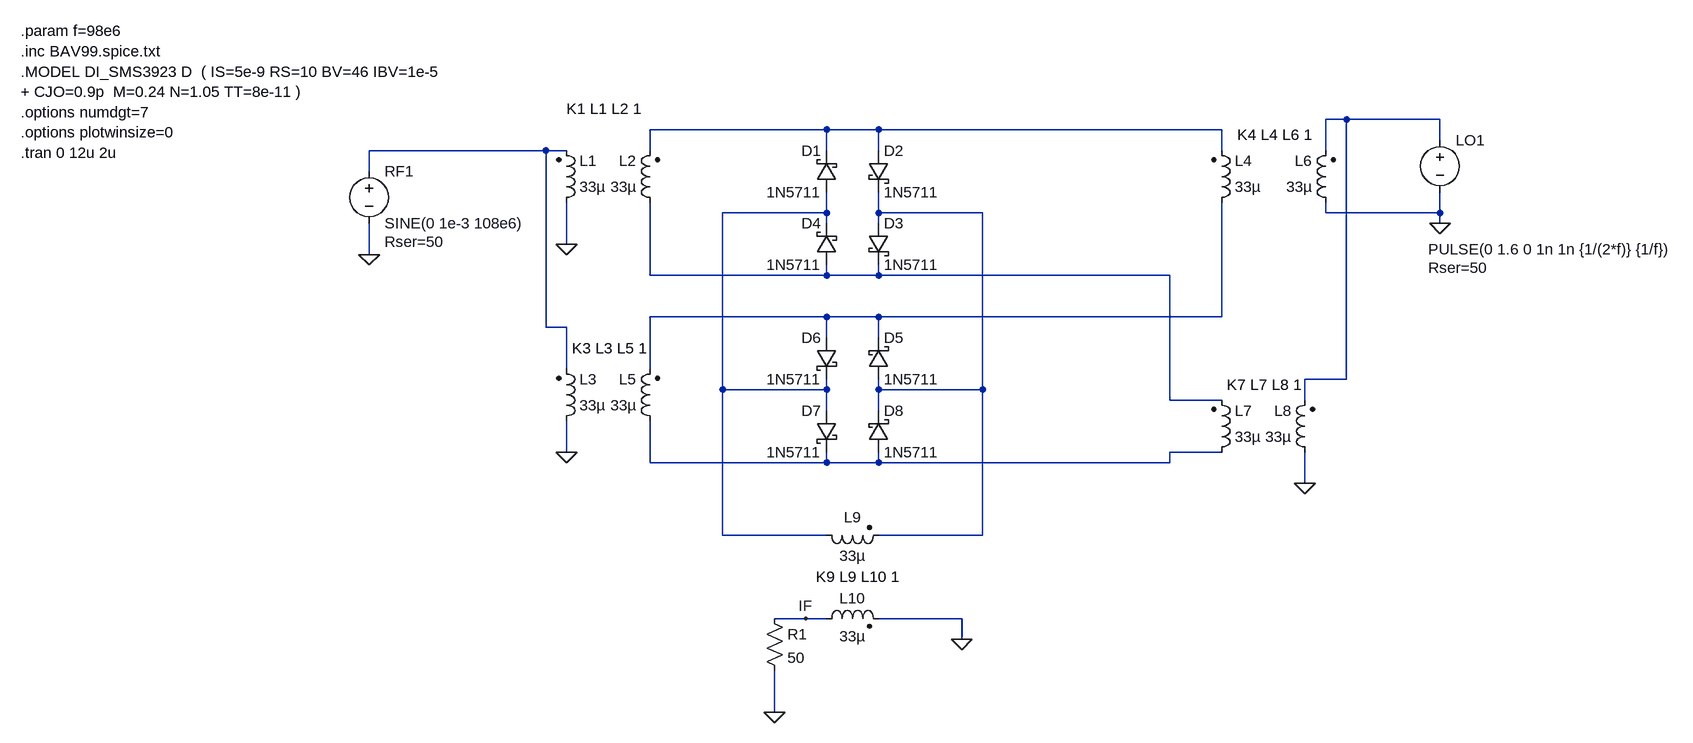
[diagram p0: schematic DDBM.asc]
DDBM.asc, the LTspice schematic file:
Version 4
SHEET 1 1816 852
WIRE 992 -80 960 -80
WIRE 1136 -80 992 -80
WIRE 192 -64 -80 -64
WIRE 272 -64 192 -64
WIRE 800 -64 272 -64
WIRE 1136 -48 1136 -80
WIRE -240 -32 -512 -32
WIRE -208 -32 -240 -32
WIRE -80 -32 -80 -64
WIRE 192 -32 192 -64
WIRE 272 -32 272 -64
WIRE 800 -32 800 -64
WIRE 960 -32 960 -80
WIRE -512 0 -512 -32
WIRE 192 64 192 32
WIRE 192 64 32 64
WIRE 272 64 272 32
WIRE 432 64 272 64
WIRE 960 64 960 48
WIRE 1136 64 1136 32
WIRE 1136 64 960 64
WIRE 192 80 192 64
WIRE 272 80 272 64
WIRE 1136 80 1136 64
WIRE -208 112 -208 48
WIRE -512 128 -512 80
WIRE -80 160 -80 48
WIRE 192 160 192 144
WIRE 192 160 -80 160
WIRE 272 160 272 144
WIRE 272 160 192 160
WIRE 720 160 272 160
WIRE 192 224 -80 224
WIRE 272 224 192 224
WIRE 800 224 800 48
WIRE 800 224 272 224
WIRE -240 240 -240 -32
WIRE -208 240 -240 240
WIRE 192 256 192 224
WIRE 272 256 272 224
WIRE -208 304 -208 240
WIRE -80 304 -80 224
WIRE 992 320 992 -80
WIRE 992 320 928 320
WIRE 32 336 32 64
WIRE 192 336 192 320
WIRE 192 336 32 336
WIRE 272 336 272 320
WIRE 432 336 432 64
WIRE 432 336 272 336
WIRE 720 352 720 160
WIRE 800 352 720 352
WIRE 928 352 928 320
WIRE 192 368 192 336
WIRE 272 368 272 336
WIRE -208 432 -208 384
WIRE 800 432 720 432
WIRE -80 448 -80 384
WIRE 192 448 192 432
WIRE 192 448 -80 448
WIRE 272 448 272 432
WIRE 272 448 192 448
WIRE 720 448 720 432
WIRE 720 448 272 448
WIRE 928 480 928 432
WIRE 32 560 32 336
WIRE 192 560 32 560
WIRE 432 560 432 336
WIRE 432 560 272 560
WIRE 160 688 112 688
WIRE 192 688 160 688
WIRE 400 688 272 688
WIRE 400 720 400 688
WIRE 112 832 112 768
FLAG -512 128 0
FLAG 1136 80 0
FLAG -208 112 0
FLAG -208 432 0
FLAG 400 720 0
FLAG 112 832 0
FLAG 928 480 0
FLAG 160 688 IF
SYMBOL voltage 1136 -64 R0
WINDOW 3 -18 184 Left 2
WINDOW 123 0 0 Left 0
WINDOW 39 -18 212 Left 2
SYMATTR Value PULSE(0 1.6 0 1n 1n {1/(2*f)} {1/f})
SYMATTR SpiceLine Rser=50
SYMATTR InstName LO1
SYMBOL ind2 -224 64 M180
WINDOW 0 36 80 Left 2
WINDOW 3 36 40 Left 2
SYMATTR InstName L1
SYMATTR Value 33µ
SYMATTR Type ind
SYMBOL ind2 -64 64 R180
WINDOW 0 36 80 Left 2
WINDOW 3 36 40 Left 2
SYMATTR InstName L2
SYMATTR Value 33µ
SYMATTR Type ind
SYMBOL ind2 784 64 M180
WINDOW 0 36 80 Left 2
WINDOW 3 36 40 Left 2
SYMATTR InstName L4
SYMATTR Value 33µ
SYMATTR Type ind
SYMATTR SpiceLine Rser=0.01
SYMBOL ind2 976 64 R180
WINDOW 0 36 80 Left 2
WINDOW 3 36 40 Left 2
SYMATTR InstName L6
SYMATTR Value 33µ
SYMATTR Type ind
SYMBOL schottky 208 32 R180
WINDOW 0 24 64 Left 2
WINDOW 3 24 0 Left 2
SYMATTR InstName D1
SYMATTR Value 1N5711
SYMATTR Description Diode
SYMATTR Type diode
SYMBOL voltage -512 -16 R0
WINDOW 123 0 0 Left 0
WINDOW 39 24 124 Left 2
SYMATTR SpiceLine Rser=50
SYMATTR InstName RF1
SYMATTR Value SINE(0 1e-3 108e6)
SYMBOL schottky 256 -32 R0
SYMATTR InstName D2
SYMATTR Value 1N5711
SYMATTR Description Diode
SYMATTR Type diode
SYMBOL schottky 256 80 R0
SYMATTR InstName D3
SYMATTR Value 1N5711
SYMATTR Description Diode
SYMATTR Type diode
SYMBOL schottky 208 144 R180
WINDOW 0 24 64 Left 2
WINDOW 3 24 0 Left 2
SYMATTR InstName D4
SYMATTR Value 1N5711
SYMATTR Description Diode
SYMATTR Type diode
SYMBOL ind2 -224 400 M180
WINDOW 0 36 80 Left 2
WINDOW 3 36 40 Left 2
SYMATTR InstName L3
SYMATTR Value 33µ
SYMATTR Type ind
SYMATTR SpiceLine Rser=0.0001
SYMBOL ind2 -64 400 R180
WINDOW 0 36 80 Left 2
WINDOW 3 36 40 Left 2
SYMATTR InstName L5
SYMATTR Value 33µ
SYMATTR Type ind
SYMBOL ind2 784 448 M180
WINDOW 0 36 80 Left 2
WINDOW 3 36 40 Left 2
SYMATTR InstName L7
SYMATTR Value 33µ
SYMATTR Type ind
SYMBOL ind2 944 448 R180
WINDOW 0 36 80 Left 2
WINDOW 3 36 40 Left 2
SYMATTR InstName L8
SYMATTR Value 33µ
SYMATTR Type ind
SYMATTR SpiceLine Rser=0.01
SYMBOL schottky 256 320 M180
WINDOW 0 24 64 Left 2
WINDOW 3 24 0 Left 2
SYMATTR InstName D5
SYMATTR Value 1N5711
SYMATTR Description Diode
SYMATTR Type diode
SYMBOL schottky 208 256 M0
SYMATTR InstName D6
SYMATTR Value 1N5711
SYMATTR Description Diode
SYMATTR Type diode
SYMBOL schottky 208 368 M0
SYMATTR InstName D7
SYMATTR Value 1N5711
SYMATTR Description Diode
SYMATTR Type diode
SYMBOL schottky 256 432 M180
WINDOW 0 24 64 Left 2
WINDOW 3 24 0 Left 2
SYMATTR InstName D8
SYMATTR Value 1N5711
SYMATTR Description Diode
SYMATTR Type diode
SYMBOL ind2 176 544 M90
WINDOW 0 4 56 VBottom 2
WINDOW 3 32 56 VTop 2
SYMATTR InstName L9
SYMATTR Value 33µ
SYMATTR Type ind
SYMBOL ind2 176 704 R270
WINDOW 0 32 56 VTop 2
WINDOW 3 4 56 VBottom 2
SYMATTR InstName L10
SYMATTR Value 33µ
SYMATTR Type ind
SYMBOL res 96 672 R0
SYMATTR InstName R1
SYMATTR Value 50
TEXT -208 -96 Left 2 !K1 L1 L2 1
TEXT -1048 -216 Left 2 !.param f=98e6\n.inc BAV99.spice.txt\n.MODEL DI_SMS3923 D  ( IS=5e-9 RS=10 BV=46 IBV=1e-5\n+ CJO=0.9p  M=0.24 N=1.05 TT=8e-11 )\n.options numdgt=7\n.options plotwinsize=0\n.tran 0 12u 2u
TEXT -200 272 Left 2 !K3 L3 L5 1
TEXT 824 -56 Left 2 !K4 L4 L6 1
TEXT 808 328 Left 2 !K7 L7 L8 1
TEXT 176 624 Left 2 !K9 L9 L10 1

The netlist it stands for:
* DDBM.asc
V§LO1 N001 0 PULSE(0 1.6 0 1n 1n {1/(2*f)} {1/f}) Rser=50
L1 0 N003 33µ
L2 N006 N002 33µ
L4 N007 N002 33µ Rser=0.01
L6 0 N001 33µ
D1 N004 N002 1N5711
V§RF1 N003 0 SINE(0 1e-3 108e6) Rser=50
D2 N002 N005 1N5711
D3 N005 N006 1N5711
D4 N006 N004 1N5711
L3 0 N003 33µ Rser=0.0001
L5 N008 N007 33µ
L7 N008 N006 33µ
L8 0 N001 33µ Rser=0.01
D5 N005 N007 1N5711
D6 N007 N004 1N5711
D7 N004 N008 1N5711
D8 N008 N005 1N5711
L9 N004 N005 33µ
L10 IF 0 33µ
R1 IF 0 50
.model D D
.lib standard.dio
K1 L1 L2 1
.param f=98e6
.inc BAV99.spice.txt
.MODEL DI_SMS3923 D  ( IS=5e-9 RS=10 BV=46 IBV=1e-5
+ CJO=0.9p  M=0.24 N=1.05 TT=8e-11 )
.options numdgt=7
.options plotwinsize=0
.tran 0 12u 2u
K3 L3 L5 1
K4 L4 L6 1
K7 L7 L8 1
K9 L9 L10 1
.backanno
.end